# Altium schematic sheet relays0.SchDoc
size A4
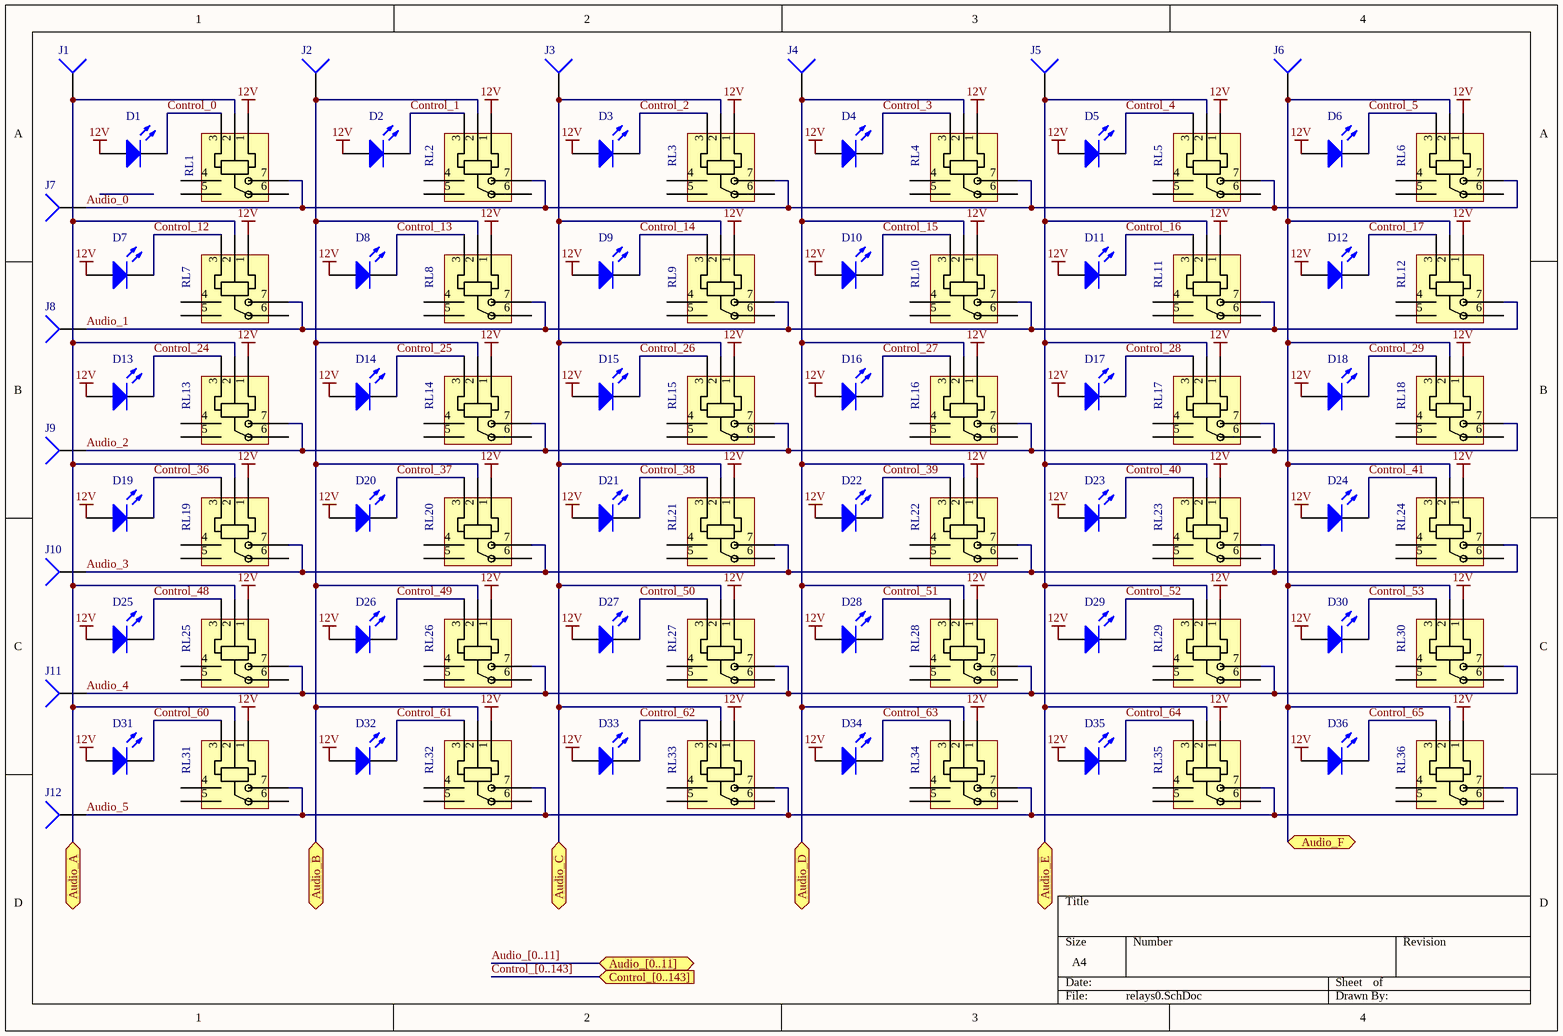
[diagram p0: relays0.SchDoc]

## Parts
D1  LED0  [LED_round_5mm]  (value not drawn)
D2  LED0  [LED_round_5mm]  (value not drawn)
D3  LED0  [LED_round_5mm]  (value not drawn)
D4  LED0  [LED_round_5mm]  (value not drawn)
D5  LED0  [LED_round_5mm]  (value not drawn)
D6  LED0  [LED_round_5mm]  (value not drawn)
D7  LED0  [LED_round_5mm]  (value not drawn)
D8  LED0  [LED_round_5mm]  (value not drawn)
D9  LED0  [LED_round_5mm]  (value not drawn)
D10  LED0  [LED_round_5mm]  (value not drawn)
D11  LED0  [LED_round_5mm]  (value not drawn)
D12  LED0  [LED_round_5mm]  (value not drawn)
D13  LED0  [LED_round_5mm]  (value not drawn)
D14  LED0  [LED_round_5mm]  (value not drawn)
D15  LED0  [LED_round_5mm]  (value not drawn)
D16  LED0  [LED_round_5mm]  (value not drawn)
D17  LED0  [LED_round_5mm]  (value not drawn)
D18  LED0  [LED_round_5mm]  (value not drawn)
D19  LED0  [LED_round_5mm]  (value not drawn)
D20  LED0  [LED_round_5mm]  (value not drawn)
D21  LED0  [LED_round_5mm]  (value not drawn)
D22  LED0  [LED_round_5mm]  (value not drawn)
D23  LED0  [LED_round_5mm]  (value not drawn)
D24  LED0  [LED_round_5mm]  (value not drawn)
D25  LED0  [LED_round_5mm]  (value not drawn)
D26  LED0  [LED_round_5mm]  (value not drawn)
D27  LED0  [LED_round_5mm]  (value not drawn)
D28  LED0  [LED_round_5mm]  (value not drawn)
D29  LED0  [LED_round_5mm]  (value not drawn)
D30  LED0  [LED_round_5mm]  (value not drawn)
D31  LED0  [LED_round_5mm]  (value not drawn)
D32  LED0  [LED_round_5mm]  (value not drawn)
D33  LED0  [LED_round_5mm]  (value not drawn)
D34  LED0  [LED_round_5mm]  (value not drawn)
D35  LED0  [LED_round_5mm]  (value not drawn)
D36  LED0  [LED_round_5mm]  (value not drawn)
J1  Audio  [Conn_1_2x4]  (value not drawn)
J2  Audio  [Conn_1_2x4]  (value not drawn)
J3  Audio  [Conn_1_2x4]  (value not drawn)
J4  Audio  [Conn_1_2x4]  (value not drawn)
J5  Audio  [Conn_1_2x4]  (value not drawn)
J6  Audio  [Conn_1_2x4]  (value not drawn)
J7  Audio  [Conn_1_2x4]  (value not drawn)
J8  Audio  [Conn_1_2x4]  (value not drawn)
J9  Audio  [Conn_1_2x4]  (value not drawn)
J10  Audio  [Conn_1_2x4]  (value not drawn)
J11  Audio  [Conn_1_2x4]  (value not drawn)
J12  Audio  [Conn_1_2x4]  (value not drawn)
RL1  Relay  [Relay_FRA3]  (value not drawn)
RL2  Relay  [Relay_FRA3]  (value not drawn)
RL3  Relay  [Relay_FRA3]  (value not drawn)
RL4  Relay  [Relay_FRA3]  (value not drawn)
RL5  Relay  [Relay_FRA3]  (value not drawn)
RL6  Relay  [Relay_FRA3]  (value not drawn)
RL7  Relay  [Relay_FRA3]  (value not drawn)
RL8  Relay  [Relay_FRA3]  (value not drawn)
RL9  Relay  [Relay_FRA3]  (value not drawn)
RL10  Relay  [Relay_FRA3]  (value not drawn)
RL11  Relay  [Relay_FRA3]  (value not drawn)
RL12  Relay  [Relay_FRA3]  (value not drawn)
RL13  Relay  [Relay_FRA3]  (value not drawn)
RL14  Relay  [Relay_FRA3]  (value not drawn)
RL15  Relay  [Relay_FRA3]  (value not drawn)
RL16  Relay  [Relay_FRA3]  (value not drawn)
RL17  Relay  [Relay_FRA3]  (value not drawn)
RL18  Relay  [Relay_FRA3]  (value not drawn)
RL19  Relay  [Relay_FRA3]  (value not drawn)
RL20  Relay  [Relay_FRA3]  (value not drawn)
RL21  Relay  [Relay_FRA3]  (value not drawn)
RL22  Relay  [Relay_FRA3]  (value not drawn)
RL23  Relay  [Relay_FRA3]  (value not drawn)
RL24  Relay  [Relay_FRA3]  (value not drawn)
RL25  Relay  [Relay_FRA3]  (value not drawn)
RL26  Relay  [Relay_FRA3]  (value not drawn)
RL27  Relay  [Relay_FRA3]  (value not drawn)
RL28  Relay  [Relay_FRA3]  (value not drawn)
RL29  Relay  [Relay_FRA3]  (value not drawn)
RL30  Relay  [Relay_FRA3]  (value not drawn)
RL31  Relay  [Relay_FRA3]  (value not drawn)
RL32  Relay  [Relay_FRA3]  (value not drawn)
RL33  Relay  [Relay_FRA3]  (value not drawn)
RL34  Relay  [Relay_FRA3]  (value not drawn)
RL35  Relay  [Relay_FRA3]  (value not drawn)
RL36  Relay  [Relay_FRA3]  (value not drawn)

## Ports
Audio_[0..11] (bidir), Audio_A (bidir), Audio_B (bidir), Audio_C (bidir), Audio_D (bidir), Audio_E (bidir), Audio_F (bidir), Control_[0..143] (in)

## Nets
12V: D1.1(A) D2.1(A) D3.1(A) D4.1(A) D5.1(A) D6.1(A) D7.1(A) D8.1(A) D9.1(A) D10.1(A) D11.1(A) D12.1(A) D13.1(A) D14.1(A) D15.1(A) D16.1(A) D17.1(A) D18.1(A) D19.1(A) D20.1(A) D21.1(A) D22.1(A) D23.1(A) D24.1(A) D25.1(A) D26.1(A) D27.1(A) D28.1(A) D29.1(A) D30.1(A) D31.1(A) D32.1(A) D33.1(A) D34.1(A) D35.1(A) D36.1(A) RL1.1 RL2.1 RL3.1 RL4.1 RL5.1 RL6.1 RL7.1 RL8.1 RL9.1 RL10.1 RL11.1 RL12.1 RL13.1 RL14.1 RL15.1 RL16.1 RL17.1 RL18.1 RL19.1 RL20.1 RL21.1 RL22.1 RL23.1 RL24.1 RL25.1 RL26.1 RL27.1 RL28.1 RL29.1 RL30.1 RL31.1 RL32.1 RL33.1 RL34.1 RL35.1 RL36.1
Audio_0: J7.1 RL1.7 RL2.7 RL3.7 RL4.7 RL5.7 RL6.7
Audio_1: J8.1 RL7.7 RL8.7 RL9.7 RL10.7 RL11.7 RL12.7
Audio_2: J9.1 RL13.7 RL14.7 RL15.7 RL16.7 RL17.7 RL18.7
Audio_3: J10.1 RL19.7 RL20.7 RL21.7 RL22.7 RL23.7 RL24.7
Audio_4: J11.1 RL25.7 RL26.7 RL27.7 RL28.7 RL29.7 RL30.7
Audio_5: J12.1 RL31.7 RL32.7 RL33.7 RL34.7 RL35.7 RL36.7
Audio_A: J1.1 RL1.2 RL7.2 RL13.2 RL19.2 RL25.2 RL31.2 ; port Audio_A
Audio_B: J2.1 RL2.2 RL8.2 RL14.2 RL20.2 RL26.2 RL32.2 ; port Audio_B
Audio_C: J3.1 RL3.2 RL9.2 RL15.2 RL21.2 RL27.2 RL33.2 ; port Audio_C
Audio_D: J4.1 RL4.2 RL10.2 RL16.2 RL22.2 RL28.2 RL34.2 ; port Audio_D
Audio_E: J5.1 RL5.2 RL11.2 RL17.2 RL23.2 RL29.2 RL35.2 ; port Audio_E
Audio_F: J6.1 RL6.2 RL12.2 RL18.2 RL24.2 RL30.2 RL36.2 ; port Audio_F
Control_0: D1.2(K) RL1.3
Control_1: D2.2(K) RL2.3
Control_2: D3.2(K) RL3.3
Control_3: D4.2(K) RL4.3
Control_4: D5.2(K) RL5.3
Control_5: D6.2(K) RL6.3
Control_12: D7.2(K) RL7.3
Control_13: D8.2(K) RL8.3
Control_14: D9.2(K) RL9.3
Control_15: D10.2(K) RL10.3
Control_16: D11.2(K) RL11.3
Control_17: D12.2(K) RL12.3
Control_24: D13.2(K) RL13.3
Control_25: D14.2(K) RL14.3
Control_26: D15.2(K) RL15.3
Control_27: D16.2(K) RL16.3
Control_28: D17.2(K) RL17.3
Control_29: D18.2(K) RL18.3
Control_36: D19.2(K) RL19.3
Control_37: D20.2(K) RL20.3
Control_38: D21.2(K) RL21.3
Control_39: D22.2(K) RL22.3
Control_40: D23.2(K) RL23.3
Control_41: D24.2(K) RL24.3
Control_48: D25.2(K) RL25.3
Control_49: D26.2(K) RL26.3
Control_50: D27.2(K) RL27.3
Control_51: D28.2(K) RL28.3
Control_52: D29.2(K) RL29.3
Control_53: D30.2(K) RL30.3
Control_60: D31.2(K) RL31.3
Control_61: D32.2(K) RL32.3
Control_62: D33.2(K) RL33.3
Control_63: D34.2(K) RL34.3
Control_64: D35.2(K) RL35.3
Control_65: D36.2(K) RL36.3

Not connected (* = marked no-connect by the designer): RL1 4 5 6; RL2 4 5 6; RL3 4 5 6; RL4 4 5 6; RL5 4 5 6; RL6 4 5 6; RL7 4 5 6; RL8 4 5 6; RL9 4 5 6; RL10 4 5 6; RL11 4 5 6; RL12 4 5 6; RL13 4 5 6; RL14 4 5 6; RL15 4 5 6; RL16 4 5 6; RL17 4 5 6; RL18 4 5 6; RL19 4 5 6; RL20 4 5 6; RL21 4 5 6; RL22 4 5 6; RL23 4 5 6; RL24 4 5 6; RL25 4 5 6; RL26 4 5 6; RL27 4 5 6; RL28 4 5 6; RL29 4 5 6; RL30 4 5 6; RL31 4 5 6; RL32 4 5 6; RL33 4 5 6; RL34 4 5 6; RL35 4 5 6; RL36 4 5 6

## Buses and harness runs
bus Audio_[0..11] = port Audio_[0..11]
bus Control_[0..143] = port Control_[0..143]

## Library data of the parts
D1-D36 = LED0: Typical INFRARED GaAs LED; Published: 8-Jun-2000; LatestRevisionDate: 08-Jul-2005; LatestRevisionNote: Mech Layer 1 removed.; PackageReference: LED-0; Publisher: Altium Limited; PackageDescription: LED; 2 Leads
J1-J12 = Socket: LatestRevisionDate: 17-Jul-2002; LatestRevisionNote: Re-released for DXP Platform.; Publisher: Altium Limited
RL1-RL36 = Relay_FRA3: Miniature power relay; Part number: FRA3C-DC12